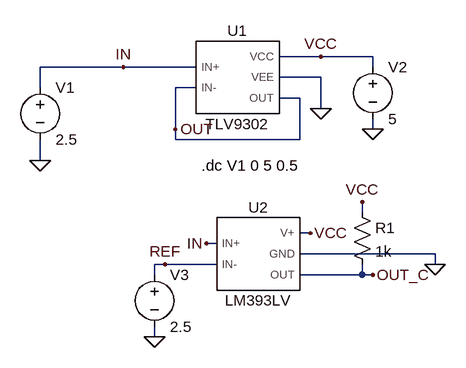
[diagram p0: schematic voltage_follower.asc]
voltage_follower.asc, the LTspice schematic file:
Version 4.1
SHEET 1 880 680
WIRE 288 128 224 128
WIRE 368 128 288 128
WIRE -16 144 -144 144
WIRE 96 144 -16 144
WIRE 368 144 368 128
WIRE 288 160 224 160
WIRE -144 176 -144 144
WIRE 96 176 64 176
WIRE 256 192 224 192
WIRE 288 208 288 160
WIRE 64 240 64 176
WIRE 368 240 368 224
WIRE 64 256 64 240
WIRE 256 256 256 192
WIRE 256 256 64 256
WIRE -144 288 -144 256
WIRE 352 368 352 352
WIRE 272 400 256 400
WIRE 128 416 112 416
WIRE 464 432 256 432
WIRE 48 448 32 448
WIRE 128 448 48 448
WIRE 464 448 464 432
WIRE 32 464 32 448
WIRE 352 464 352 448
WIRE 352 464 256 464
WIRE 368 464 352 464
WIRE 32 560 32 544
FLAG -144 288 0
FLAG 288 208 0
FLAG 368 240 0
FLAG -16 144 IN
FLAG 64 240 OUT
FLAG 112 416 IN
FLAG 32 560 0
FLAG 48 448 REF
FLAG 288 128 VCC
FLAG 272 400 VCC
FLAG 464 448 0
FLAG 368 464 OUT_C
FLAG 352 352 VCC
SYMBOL voltage -144 160 R0
WINDOW 123 0 0 Left 0
WINDOW 39 0 0 Left 0
SYMATTR InstName V1
SYMATTR Value 2.5
SYMBOL voltage 368 128 R0
WINDOW 123 0 0 Left 0
WINDOW 39 0 0 Left 0
SYMATTR InstName V2
SYMATTR Value 5
SYMBOL TLV9302 160 160 R0
SYMATTR InstName U1
SYMBOL voltage 32 448 R0
WINDOW 123 0 0 Left 0
WINDOW 39 0 0 Left 0
SYMATTR InstName V3
SYMATTR Value 2.5
SYMBOL LM393LV 192 432 R0
SYMATTR InstName U2
SYMBOL res 336 352 R0
SYMATTR InstName R1
SYMATTR Value 1k
TEXT 104 296 Left 2 !.dc V1 0 5 0.5

The netlist it stands for:
* voltage_follower.asc
V1 IN 0 2.5
V2 VCC 0 5
X§U1 IN OUT VCC 0 OUT TLV9302  ; pins IN+ IN- VCC VEE OUT
V3 REF 0 2.5
X§U2 IN REF VCC 0 OUT_C LM393LV  ; pins IN+ IN- V+ GND OUT
R1 VCC OUT_C 1k
.dc V1 0 5 0.5
.lib C:\Users\Tachi\Documents\robomaster_hardware\SupercapManager\SPICE_sims\libraries\tlv9302.lib
.lib C:\Users\nithi\Downloads\snom697a\lm393lv.lib
.backanno
.end